# EAGLE design picoAvaR10 (EAGLE 6.1)
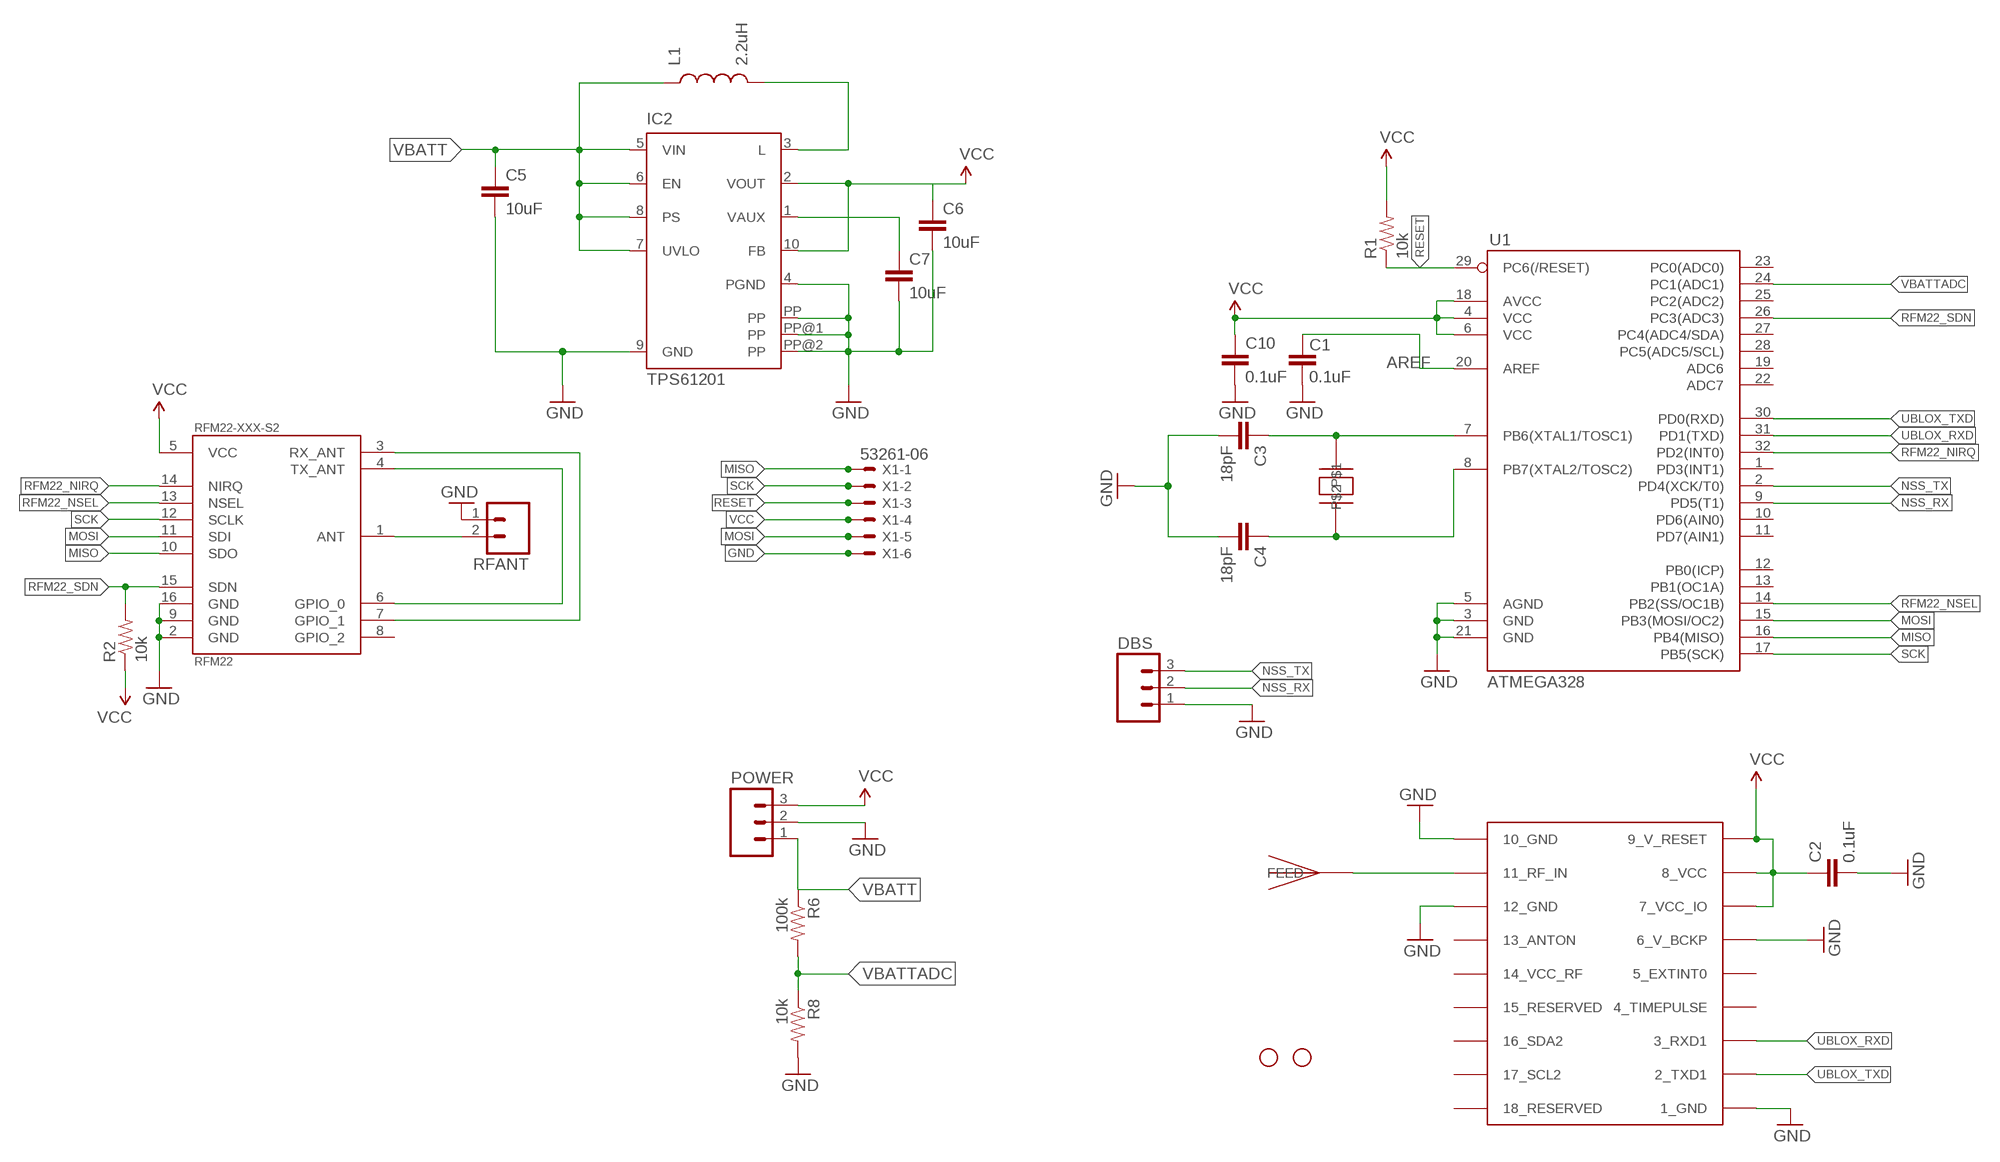
[diagram p0: schematic, sheet 1]

## Parts
C1  0.1uF  CAP0402-CAP  [0402-CAP]
C2  0.1uF  CAP0402-CAP  [0402-CAP]
C3  18pF  CAP0402-CAP  [0402-CAP]
C4  18pF  CAP0402-CAP  [0402-CAP]
C5  10uF  CAP1206  [1206]
C6  10uF  CAP1206  [1206]
C7  10uF  CAP1206  [1206]
C10  0.1uF  CAP0402-CAP  [0402-CAP]
DBS  M03PTH  [1X03]
IC2  TPS61201  [S-PDSO-N10]
JP1  STAND-OFF  [STAND-OFF]
JP2  STAND-OFF  [STAND-OFF]
L1  2.2uH  ELLVGG_INDUCTOR  [ELLVGG_INDUCTOR]
POWER  M03PTH  [1X03]
R1  10k  RESISTOR0402-RES  [0402-RES]
R2  10k  RESISTOR0402-RES  [0402-RES]
R6  100k  RESISTOR0402-RES  [0402-RES]
R8  10k  RESISTOR0402-RES  [0402-RES]
RFANT  M02PTH  [1X02]
RFM22-XXX-S2  RFM22  [RFM22-XXX-S2]
U1  ATMEGA328  ATMEGA168  [TQFP32-08]
U$1  UBLOX_MAX-6  [UBLOX_MAX-6]
U$2  ABRACON_ABM3_CRYSTAL  [ABRACON_ABM3_CRYSTAL]
U$3  JTI_ANTENNA-1575AT43A40  [JTI_ANTENNA-1575AT43A40]
X1  53261-06  [53261-06]

## Nets
AREF: C1.2 U1.20(AREF)
GND [vcc]: C1.1 C2.2 C3.2 C4.2 C5.2 C6.2 C7.2 C10.2 DBS.1 IC2.4(PGND) IC2.9(GND) IC2.PP IC2.PP@1(PP) IC2.PP@2(PP) POWER.2 R8.2 RFANT.1 RFM22-XXX-S2.2(GND) RFM22-XXX-S2.9(GND) RFM22-XXX-S2.16(GND) U1.3(GND) U1.5(AGND) U1.21(GND) U$1.1_GND U$1.6_V_BCKP U$1.10_GND U$1.12_GND X1.6
MISO: RFM22-XXX-S2.10(SDO) U1.16(PB4(MISO)) X1.1
MOSI: RFM22-XXX-S2.11(SDI) U1.15(PB3(MOSI/OC2)) X1.5
N$3: RFANT.2 RFM22-XXX-S2.1(ANT)
N$4: U$1.11_RF_IN U$3.FEED
N$5: RFM22-XXX-S2.3(RX_ANT) RFM22-XXX-S2.7(GPIO_1)
N$6: RFM22-XXX-S2.4(TX_ANT) RFM22-XXX-S2.6(GPIO_0)
N$7: IC2.3(L) L1.P$2
N$9: C3.1 U1.7(PB6(XTAL1/TOSC1)) U$2.P$2
N$10: C4.1 U1.8(PB7(XTAL2/TOSC2)) U$2.P$1
N$11: C7.1 IC2.1(VAUX)
NSS_RX: DBS.2 U1.9(PD5(T1))
NSS_TX: DBS.3 U1.2(PD4(XCK/T0))
RESET: R1.1 U1.29(PC6(/RESET)) X1.3
RFM22_NIRQ: RFM22-XXX-S2.14(NIRQ) U1.32(PD2(INT0))
RFM22_NSEL: RFM22-XXX-S2.13(NSEL) U1.14(PB2(SS/OC1B))
RFM22_SDN: R2.2 RFM22-XXX-S2.15(SDN) U1.26(PC3(ADC3))
SCK: RFM22-XXX-S2.12(SCLK) U1.17(PB5(SCK)) X1.2
UBLOX_RXD: U1.31(PD1(TXD)) U$1.3_RXD1
UBLOX_TXD: U1.30(PD0(RXD)) U$1.2_TXD1
VBATT [vcc]: C5.1 IC2.5(VIN) IC2.6(EN) IC2.7(UVLO) IC2.8(PS) L1.P$1 POWER.1 R6.1
VBATTADC: R6.2 R8.1 U1.24(PC1(ADC1))
VCC: C2.1 C6.1 C10.1 IC2.2(VOUT) IC2.10(FB) POWER.3 R1.2 R2.1 RFM22-XXX-S2.5(VCC) U1.4(VCC) U1.6(VCC) U1.18(AVCC) U$1.7_VCC_IO U$1.8_VCC U$1.9_V_RESET X1.4
Unconnected: RFM22-XXX-S2.8(GPIO_2) U1.1(PD3(INT1)) U1.10(PD6(AIN0)) U1.11(PD7(AIN1)) U1.12(PB0(ICP)) U1.13(PB1(OC1A)) U1.19(ADC6) U1.22(ADC7) U1.23(PC0(ADC0)) U1.25(PC2(ADC2)) U1.27(PC4(ADC4/SDA)) U1.28(PC5(ADC5/SCL)) U$1.4_TIMEPULSE U$1.5_EXTINT0 U$1.13_ANTON U$1.14_VCC_RF U$1.15_RESERVED U$1.16_SDA2 U$1.17_SCL2 U$1.18_RESERVED

## Library data of the parts
C1-C7 C10 = SparkFun:CAP: Capacitor Standard 0603 ceramic capacitor, and 0.1" leaded capacitor.
DBS POWER = SparkFun:M03: Header 3 Standard 3-pin 0.1" header. Use with straight break away headers (SKU : PRT-00116), right angle break away headers (PRT-00553), swiss pins (PRT-00743), machine pins (PRT-00117), and female headers (PRT-00115). Molex polarized connector foot print use with SKU : PRT-08232 with associated crimp pins and housings.
IC2 = texas:TPS6120*: LOW INPUT VOLTAGE SYNCHRONOUS BOOST CONVERTER WITH 1.3-A SWITCHES Source: http://focus.ti.com/lit/ds/symlink/tps61200.pdf; MPN: TPS61201DRCT; OC_FARNELL: unknown; OC_NEWARK: 37M0068
JP1 JP2 = SparkFun:STAND-OFF: Stand Off This is the mechanical footprint for a #4 phillips button head screw. Use the keepout ring to avoid running the screw head into surrounding components. SKU : PRT-00447
L1 = ava:ELLVGG_INDUCTOR
R1 R2 R6 R8 = SparkFun:RESISTOR: Resistor Basic schematic elements and footprints for 0603, 1206, and PTH resistors.
RFANT = SparkFun:M02: Header 2 Standard 2-pin 0.1" header. Use with straight break away headers (SKU : PRT-00116), right angle break away headers (PRT-00553), swiss pins (PRT-00743), machine pins (PRT-00117), and female headers (PRT-00115). Molex polarized connector foot print use with SKU : PRT-08233 with associated crimp pins and housings.
RFM22-XXX-S2 = SparkFun:RFM22: *Hope RF's RFM22* Packages: RFM22-S2 (SMD)
U1 = SparkFun:ATMEGA168
U$1 = ava:UBLOX_MAX-6: UBLOX MAX-6
U$2 = ava:ABRACON_ABM3_CRYSTAL
U$3 = ava:JTI_ANTENNA-1575AT43A40
X1 = con-molex:53?-06: CONNECTOR wire to board 1.25 mm (.049 inch) pitch header; OC_FARNELL: 1125375; OC_NEWARK: unknown

## Net classes
0 default: width 0.203 mm
1 vcc: width 0.254 mm

## Board
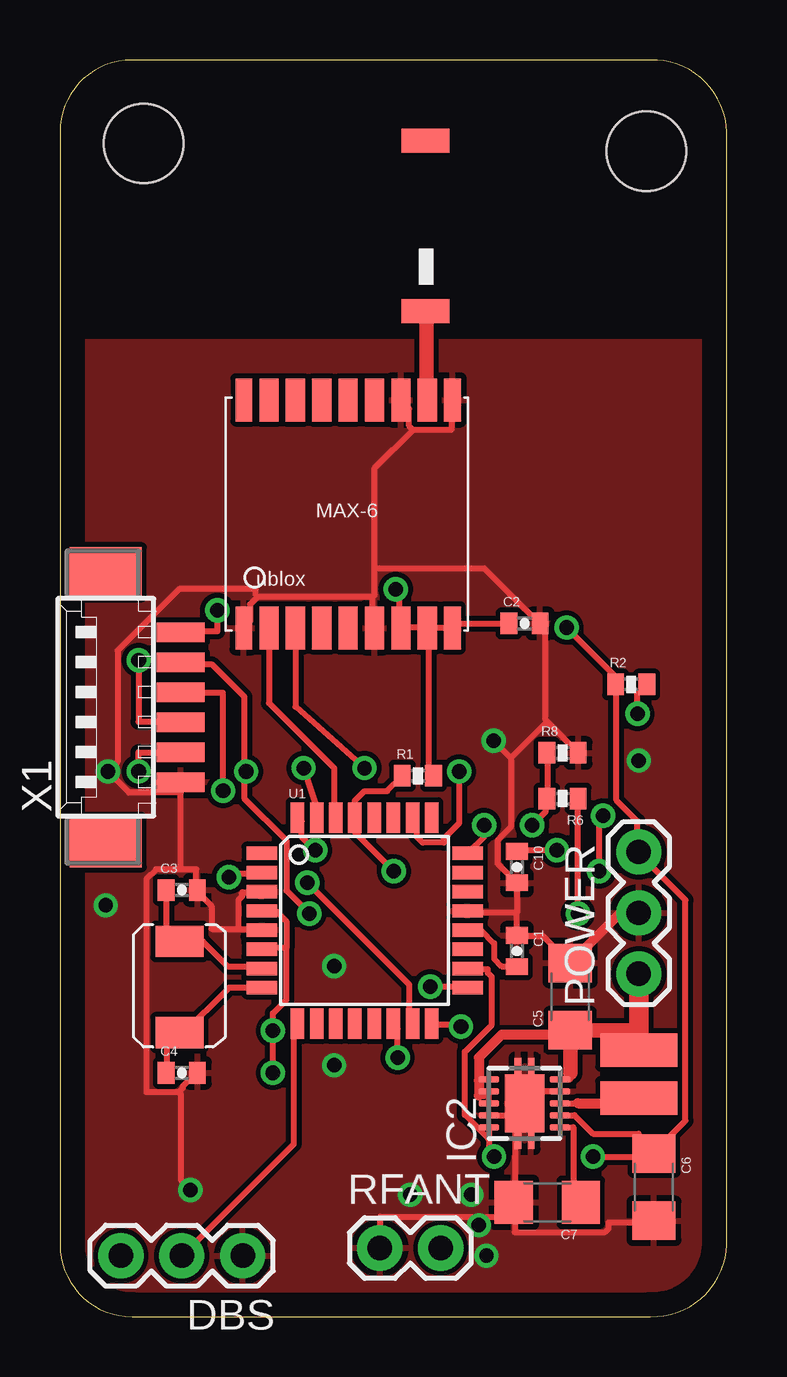
[diagram p1: board, top side]
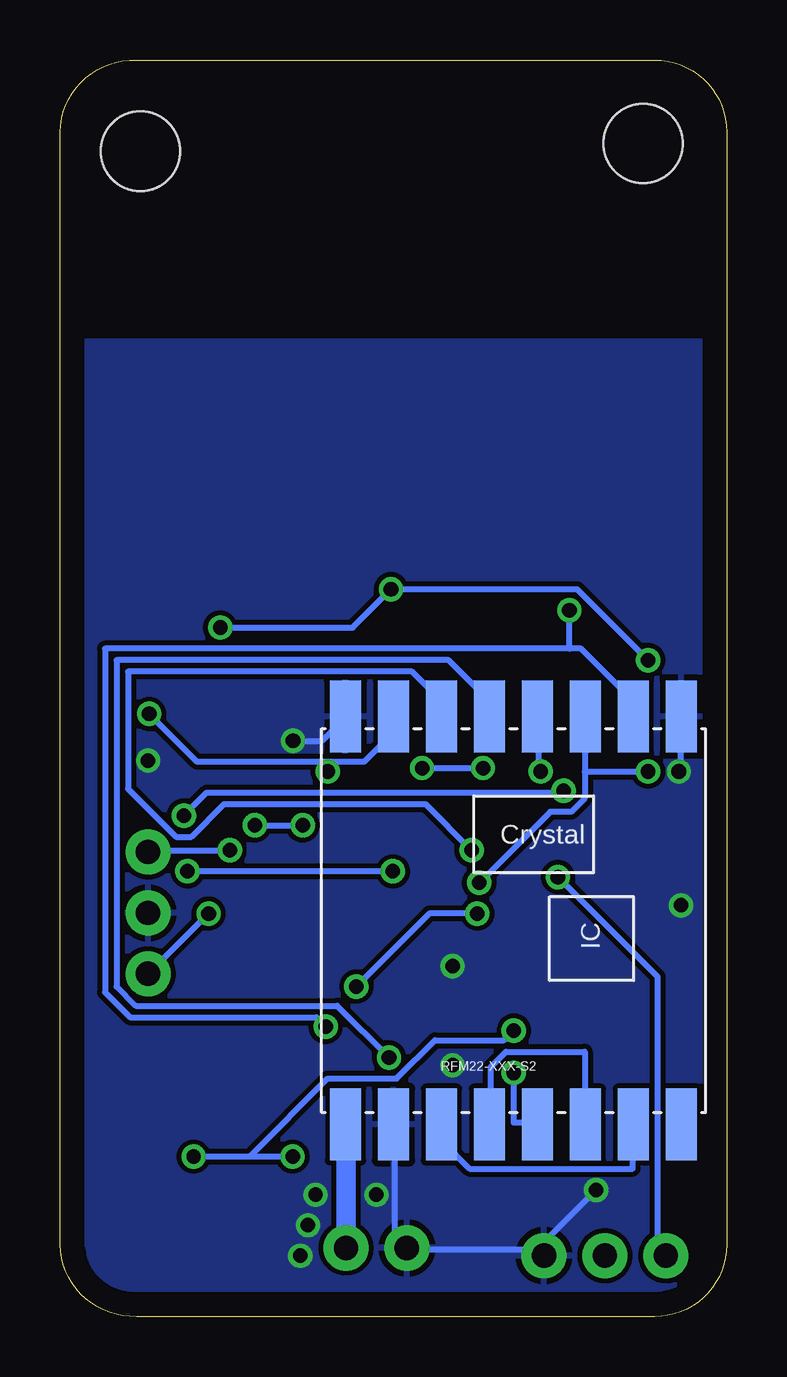
[diagram p2: board, bottom side, seen from below]

Size 27.8 x 52.38 mm. Coordinates in mm from the lower left corner, seen from the top.
Outline: 24.61,52.38 3,52.38 arc90 0,49.38 0,3 arc90 3,0 24.61,0 arc90 27.8,3 27.8,49.38 arc90 24.61,52.38
Copper layers (1*16): Top 0.035mm / dielectric 1.5mm / Bottom 0.035mm
Design rules: minimum track width 10mil, minimum drill 24mil, track to track 8mil, track to pad 8mil, pad to pad 8mil, via to via 8mil, smd to smd 8mil, copper to edge 40mil, drill to drill 8mil, minimum pad ring 10mil, minimum via ring 8mil, stop-mask expansion 4mil, vias tented up to drill 0mil, thermal gap 10mil

### Footprints (pad centres in the part's own frame; a part is rotated, then mirrored left to right if it is on the bottom)
0402-CAP = smd 0.7 x 0.9: 1 -0.65,0; 2 0.65,0
1206 = smd 1.6 x 1.8: 1 -1.4,0; 2 1.4,0
1X03 = drill 1.016 pad 1.88: 1 0,0; 2 2.54,0; 3 5.08,0
S-PDSO-N10 = smd 0.28 x 0.85: 1 -1,-1.475; 2 -0.5,-1.475; 3 0,-1.475; 4 0.5,-1.475; 5 1,-1.475; 6 1,1.475; 7 0.5,1.475; 8 0,1.475; 9 -0.5,1.475; 10 -1,1.475 | smd 2.4 x 1.65: PP 0,0 | smd 3.8 x 0.28: PP@1 0,0.275; PP@2 0,-0.275
STAND-OFF = hole 3.302: 0,0
ELLVGG_INDUCTOR = smd 1.4 x 3.2: P$1 -3.81,0; P$2 -1.81,0
0402-RES = smd 0.7 x 0.9: 1 -0.65,0; 2 0.65,0
1X02 = drill 1.016 pad 1.88: 1 0,0; 2 2.54,0
RFM22-XXX-S2 = smd 3 x 1.3: 1 -8.5,7; 2 -8.5,5; 3 -8.5,3; 4 -8.5,1; 5 -8.5,-1; 6 -8.5,-3; 7 -8.5,-5; 8 -8.5,-7; 9 8.5,-7; 10 8.5,-5; 11 8.5,-3; 12 8.5,-1; 13 8.5,1; 14 8.5,3; 15 8.5,5; 16 8.5,7
TQFP32-08 = smd 1.27 x 0.559: 1 -4.293,2.8; 2 -4.293,2; 3 -4.293,1.2; 4 -4.293,0.4; 5 -4.293,-0.4; 6 -4.293,-1.2; 7 -4.293,-2; 8 -4.293,-2.8; 17 4.293,-2.8; 18 4.293,-2; 19 4.293,-1.2; 20 4.293,-0.4; 21 4.293,0.4; 22 4.293,1.2; 23 4.293,2; 24 4.293,2.8 | smd 0.559 x 1.27: 9 -2.8,-4.293; 10 -2,-4.293; 11 -1.2,-4.293; 12 -0.4,-4.293; 13 0.4,-4.293; 14 1.2,-4.293; 15 2,-4.293; 16 2.8,-4.293; 25 2.8,4.293; 26 2,4.293; 27 1.2,4.293; 28 0.4,4.293; 29 -0.4,4.293; 30 -1.2,4.293; 31 -2,4.293; 32 -2.8,4.293
UBLOX_MAX-6 = smd 1.8 x 0.7: 1_GND 4.95,-4.4; 9_V_RESET 4.95,4.3; 10_GND -4.55,4.3; 18_RESERVED -4.55,-4.4 | smd 1.8 x 0.8: 2_TXD1 4.95,-3.35; 3_RXD1 4.95,-2.25; 4_TIMEPULSE 4.95,-1.15; 5_EXTINT0 4.95,-0.05; 6_V_BCKP 4.95,1.05; 7_VCC_IO 4.95,2.15; 8_VCC 4.95,3.25; 11_RF_IN -4.55,3.25; 12_GND -4.55,2.15; 13_ANTON -4.55,1.05; 14_VCC_RF -4.55,-0.05; 15_RESERVED -4.55,-1.15; 16_SDA2 -4.55,-2.25; 17_SCL2 -4.55,-3.35
ABRACON_ABM3_CRYSTAL = smd 1.3 x 2: P$1 -3.4,0.1; P$2 0.4,0.1
JTI_ANTENNA-1575AT43A40 = smd 1 x 2: FEED -3.81,-1.27; NC 3.29,-1.27
53261-06 = smd 0.8 x 2: 1 3.125,-2.5; 2 1.875,-2.5; 3 0.625,-2.5; 4 -0.625,-2.5; 5 -1.875,-2.5; 6 -3.125,-2.5 | smd 2.1 x 3: S1 5.625,0.625; S2 -5.625,0.625

### Placement (x,y rotation side)
C1  19.05,15.24 270 top
C2  19.37,28.89 0 top
C3  5.08,17.78 0 top
C4  5.08,10.16 0 top
C5  21.27,13.34 90 top
C6  24.77,5.4 270 top
C7  20.32,4.76 180 top
C10  19.05,18.73 270 top
DBS  7.62,2.54 180 top
IC2  19.37,8.89 90 top
JP1  3.49,48.9 0 top
JP2  24.45,48.58 0 top
L1  24.13,7.3 270 top
POWER  24.13,14.29 90 top
R1  14.92,22.54 0 top
R2  23.81,26.35 0 top
R6  20.95,21.59 180 top
R8  20.95,23.5 0 top
RFANT  13.34,2.86 0 top
RFM22-XXX-S2  8.89,16.51 90 bottom
U1  12.7,16.51 0 top
U$1  12.06,33.66 270 top
U$2  5.08,15.24 90 top
U$3  13.97,45.72 90 top
X1  2.54,25.4 90 top

### Tracks (layer width: path | path; a pad name or v marks a point on that pad's centre or on a via)
AREF
  Top 0.254: U1.20 17.55,16.11 18.1,15.56 18.1,14.92 18.41,14.61 19.04,14.61 | 19.04,14.61 19.05,14.61 | C1.2 19.04,14.64 19.04,14.61
GND  (via drill 0.6, 0.61)
  Top 0.254: IC2.4 19.68,9.39 19.68,8.96 | 19.68,8.96 19.68,8.89 | IC2.PP@1 IC2.PP 19.44,8.88 19.52,8.88 IC2.PP@2 19.68,8.96 | IC2.9 19.09,8.39 IC2.PP@1 | 19.05,16.83 C10.2 18.96,18.16 18.24,18.88 18.24,19.84 18.8,20.4 18.8,23.28 | C1.1 19.05,15.88 20.13,15.88 C5.2 | C1.1 19.05,15.92 | 19.05,15.92 19.05,16.83 | 19.05,16.83 17.14,16.83 17.04,16.88 U1.21 | C7.2 18.96,4.8 18.96,8.32 IC2.PP@1 | C6.2 24.72,3.92 22.88,3.92 22.88,3.68 22.72,3.52 18.96,3.52 18.96,4.64 C7.2 | C7.2 18.88,4.16 13.36,4.16 13.36,2.88 RFANT.1 | 4.96,9.36 5.12,9.52 5.12,9.6 5.68,10.16 C4.2 | 4.96,9.36 3.6,9.36 3.6,18.24 4,18.64 5.04,18.64 | 5.04,18.64 5.68,18.64 5.68,17.84 C3.2 5.76,17.68 6.32,17.12 6.32,16.16 7.44,16.16 | 7.44,16.16 8.4,16.16 U1.5 | 7.44,16.16 7.44,17.36 7.6,17.52 7.6,17.68 8.4,17.68 U1.3 | 5.04,18.64 5.04,21.84 | 5.04,21.84 X1.6 | 5.04,21.84 2.88,21.84 v2,22.72 2.4,23.12 2.4,27.76 4.96,30.32 8.16,30.32 8.16,30.08 8.24,30 | C1.1 19.04,15.92 19.05,15.92 | 20.32,24.8 21.6,23.52 R8.2 | 20.32,24.8 20.24,24.88 20.24,28.72 20.08,28.88 C2.2 19.92,28.96 17.68,31.2 13.12,31.2 | 20.32,24.8 18.8,23.28 | 18.8,23.28 v18.08,24 | 14.72,36.96 14.56,37.12 14.56,37.84 14.24,38.16 U$1.12_GND | 14.72,36.96 16.32,36.96 16.32,38.16 U$1.10_GND | U$1.1_GND 7.92,28.96 7.92,29.68 8.24,30 | 13.04,30 8.24,30 | 13.04,30 13.04,28.72 U$1.6_V_BCKP | 14.72,36.96 13.12,35.36 13.12,31.2 | 13.12,31.2 13.12,30.08 13.04,30 | v5.44,5.28 5.04,5.68 5.04,9.28 4.96,9.36
  Top 0.406: POWER.2 23.36,16.83 C5.2
  Bottom 0.254: RFM22-XXX-S2.2 13.84,8 13.84,2.88 13.36,2.88 RFANT.1 13.28,2.8 7.92,2.8 7.68,2.56 DBS.1 7.84,2.88 v5.44,5.28 | v2,22.72 1.92,22.72 1.92,24.96 RFM22-XXX-S2.9 | v18.08,24 16.88,24 15.92,24.96 RFM22-XXX-S2.16
  other vias: 11.43,14.61 1.91,17.14 11.43,10.48 17.14,5.08 14.61,5.08 17.46,3.81 17.78,2.54 24.13,23.18
  pour Top: 0,40.64 26.99,40.64 26.99,0 3,0 arc-90 0,3
  pour Bottom: 0,40.64 26.99,40.64 26.99,0 3,0 arc-90 0,3
MISO  (via drill 0.61)
  Top 0.254: v16.72,12.08 16.72,12.16 15.52,12.16 U1.16 | v6.56,29.44 6.56,28.56 5.04,28.56 X1.1
  Bottom 0.254: v16.72,12.08 17.12,12.48 24.88,12.48 25.92,13.52 25.92,27.84 6.56,27.84 | 6.56,27.84 6.08,27.84 3.92,25.68 3.92,25.04 RFM22-XXX-S2.10 | 6.56,27.84 v6.56,29.44
MOSI  (via drill 0.61)
  Top 0.254: v10.32,18.08 14.56,13.84 14.56,12.32 14.64,12.24 U1.15 | v3.28,22.72 3.28,23.52 X1.5
  Bottom 0.254: v10.32,18.08 7.36,21.04 6.48,21.04 5.92,21.6 5.92,22.72 | 5.92,22.72 5.92,24.96 RFM22-XXX-S2.11 | 5.92,22.72 v3.28,22.72
N$3
  Bottom 0.254: 15.88,8 RFM22-XXX-S2.1
  Bottom 0.813: RFANT.2 15.88,8
N$4
  Top 0.254: 15.28,38.24 U$1.11_RF_IN | 15.28,41.84 U$3.FEED
  Top 0.61: 15.28,41.84 15.28,38.24
N$5
  Bottom 0.254: RFM22-XXX-S2.7 3.92,8 3.92,6.16 10.72,6.16 11.84,7.28 11.84,8 RFM22-XXX-S2.3
N$6
  Bottom 0.254: RFM22-XXX-S2.6 5.92,8.08 5.92,11.04 9.2,11.04 9.84,10.4 9.84,8.08 RFM22-XXX-S2.4
N$7
  Top 0.254: IC2.3 21.59,8.89
  Top 0.406: 24.13,9.21 L1.P$2 24.13,8.89 21.59,8.89
N$9
  Top 0.254: U1.7 8.31,14.61 6.99,14.61 5.95,15.64 U$2.P$2 4.9,15.56 4.45,15.56 4.43,15.57 C3.1
N$10
  Top 0.254: U1.8 7.04,13.71 5.08,11.75 5.07,11.75 U$2.P$1 4.54,11.84 4.45,11.75 4.45,10.18 C4.1
N$11
  Top 0.254: IC2.1 21.4,7.89 21.4,4.89 21.27,4.76 21.59,4.76 21.68,4.8 C7.1
NSS_RX
  Top 0.254: U1.9 9.84,12.16 9.76,12.08 9.76,7.2 5.12,2.56 DBS.2
NSS_TX  (via drill 0.61)
  Top 0.254: v7.04,18.32 7.04,18.48 8.4,18.48 U1.2
  Bottom 0.254: v7.04,18.32 2.88,14.16 2.88,2.56 2.56,2.56 DBS.3
RESET  (via drill 0.61)
  Top 0.254: R1.1 13.64,21.91 12.7,21.91 12.3,21.51 U1.29 12.32,20.72 12.32,20.16 v13.92,18.56 | v6.8,21.92 6.8,26 5.04,26 X1.3 | v22.64,20.88 22.48,20.72 v22.48,18.56
  Bottom 0.254: v6.8,21.92 6.88,21.84 21.68,21.84 v22.64,20.88 | v13.92,18.56 v22.48,18.56
RFM22_NIRQ  (via drill 0.61)
  Top 0.254: v10.64,19.44 10.08,20 10.08,20.64 9.92,20.8 U1.32
  Bottom 0.254: v10.64,19.44 12.56,21.36 20.96,21.36 22.32,20 22.96,20 24.96,22 24.96,26.88 13.12,26.88 11.92,25.68 11.92,25.04 RFM22-XXX-S2.14
RFM22_NSEL  (via drill 0.61)
  Top 0.254: v14.08,10.8 14.08,12 13.92,12.16 U1.14
  Bottom 0.254: v14.08,10.8 16.24,12.96 24.64,12.96 25.44,13.76 25.44,27.36 11.6,27.36 9.92,25.68 9.92,25.04 RFM22-XXX-S2.13
RFM22_SDN  (via drill 0.61)
  Top 0.254: v24.08,25.12 24.08,26 24.4,26.32 R2.2 | v16.64,22.72 16.64,20.56 16,19.92 16,19.76 15.12,19.76 14.88,20 14.88,20.64 14.72,20.8 U1.26
  Bottom 0.254: v24.08,25.12 22.08,23.12 16.64,23.12 | 16.64,23.12 15.12,23.12 13.92,24.32 13.92,24.96 RFM22-XXX-S2.15 | 16.64,23.12 v16.64,22.72
SCK  (via drill 0.61)
  Top 0.254: v15.44,13.76 16.96,13.76 U1.17 | v10.4,16.8 9.44,17.76 9.44,19.84 7.68,21.6 7.68,22.72 | 7.68,22.72 7.68,25.84 6.32,27.2 5.04,27.2 X1.2 | v7.76,22.72 7.68,22.72
  Bottom 0.254: v15.44,13.76 12.4,16.8 v10.4,16.8 | v7.76,22.72 7.84,22.72 7.84,24.96 RFM22-XXX-S2.12
UBLOX_RXD  (via drill 0.6)
  Top 0.254: U$1.3_RXD1 9.81,25.43 v12.7,22.86 | v10.16,22.86 10.79,20.9 U1.31
  Bottom 0.254: v12.7,22.86 v10.16,22.86
UBLOX_TXD
  Top 0.254: U$1.2_TXD1 8.71,25.57 11.43,22.86 11.43,20.73 | 11.43,20.64 11.43,20.73 | 11.43,20.73 U1.30
VBATT  (via drill 0.61)
  Top 0.254: 21.27,10.16 21.27,9.89 IC2.5 21,9.89 21.27,10.16 | 21.27,10.16 21.27,11.43 20.95,11.75 | 17.46,9.21 17.71,9.21 IC2.7 IC2.8 | IC2.6 17.51,9.89 17.46,9.84 | v21.6,16.8 21.6,21.52 R6.1
  Top 0.406: 20.95,11.75 18.41,11.75 17.46,10.79 17.46,9.84 17.46,9.21
  Top 0.61: 21.27,10.16 C5.1 24.13,11.94 L1.P$1
  Top 0.813: L1.P$1 POWER.1
  Bottom 0.254: v21.6,16.8 24.08,14.32 POWER.1
VBATTADC  (via drill 0.61)
  Top 0.254: R8.1 20.32,23.44 20.32,21.6 R6.2 20.24,21.52 20.24,21.04 v19.68,20.48 | v17.68,20.48 17.68,20 17.04,19.36 U1.24
  Bottom 0.254: v19.68,20.48 v17.68,20.48
VCC  (via drill 0.6, 0.61)
  Top 0.254: IC2.10 17.89,7.44 | 17.89,7.44 17.89,6.87 v18.1,6.67 | v22.23,6.67 24.13,6.67 24.13,6.8 | IC2.2 21.45,8.39 22.23,7.62 24.13,7.62 24.13,6.8 | C2.1 18.64,28.88 16.4,28.88 16.4,28.72 U$1.9_V_RESET 16.24,28.72 15.44,28.72 U$1.8_VCC | R1.2 15.52,22.56 15.36,22.72 15.36,28.64 U$1.8_VCC | U$1.8_VCC 15.2,28.72 14.24,28.72 U$1.7_VCC_IO 14.16,28.8 14.16,30.16 v14,30.32 | v3.28,27.36 3.28,24.8 5.04,24.8 X1.4 | v20.72,19.44 19.12,19.44 C10.1 | 9.44,15.36 8.48,15.36 U1.6 | 9.44,15.36 9.44,16.48 9.04,16.88 8.48,16.88 U1.4 | 9.44,15.36 9.44,13.2 8.88,12.64 v8.88,11.92 v8.88,10.16 | U1.18 17.04,14.48 17.84,14.48 17.84,14.32 18,14.16 18,12.16 16.88,11.04 16.88,8.4 17.84,7.44 17.89,7.44 | 24.13,6.8 24.72,6.8 C6.1 24.8,6.88 26.08,8.16 26.08,17.36 24.16,19.28 POWER.3 24.08,19.44 24.08,20.64 23.2,21.52 23.2,26.32 R2.1 23.2,26.48 23.2,26.64 v21.12,28.72
  Bottom 0.254: v18.1,6.67 19.84,6.67 | 19.84,6.67 v22.23,6.67 | v3.28,27.36 6.24,30.32 v14,30.32 15.6,28.72 v21.12,28.72 | v20.72,19.44 24.08,19.44 POWER.3 | v8.88,10.16 8.88,8.08 7.92,8.08 RFM22-XXX-S2.5 | v8.88,11.92 9.28,11.52 12.16,11.52 13.76,9.92 16.64,9.92 19.84,6.72 19.84,6.67